# Altium schematic sheet 24 PIN MUX TABLE.SchDoc
size 513 x 386 mm
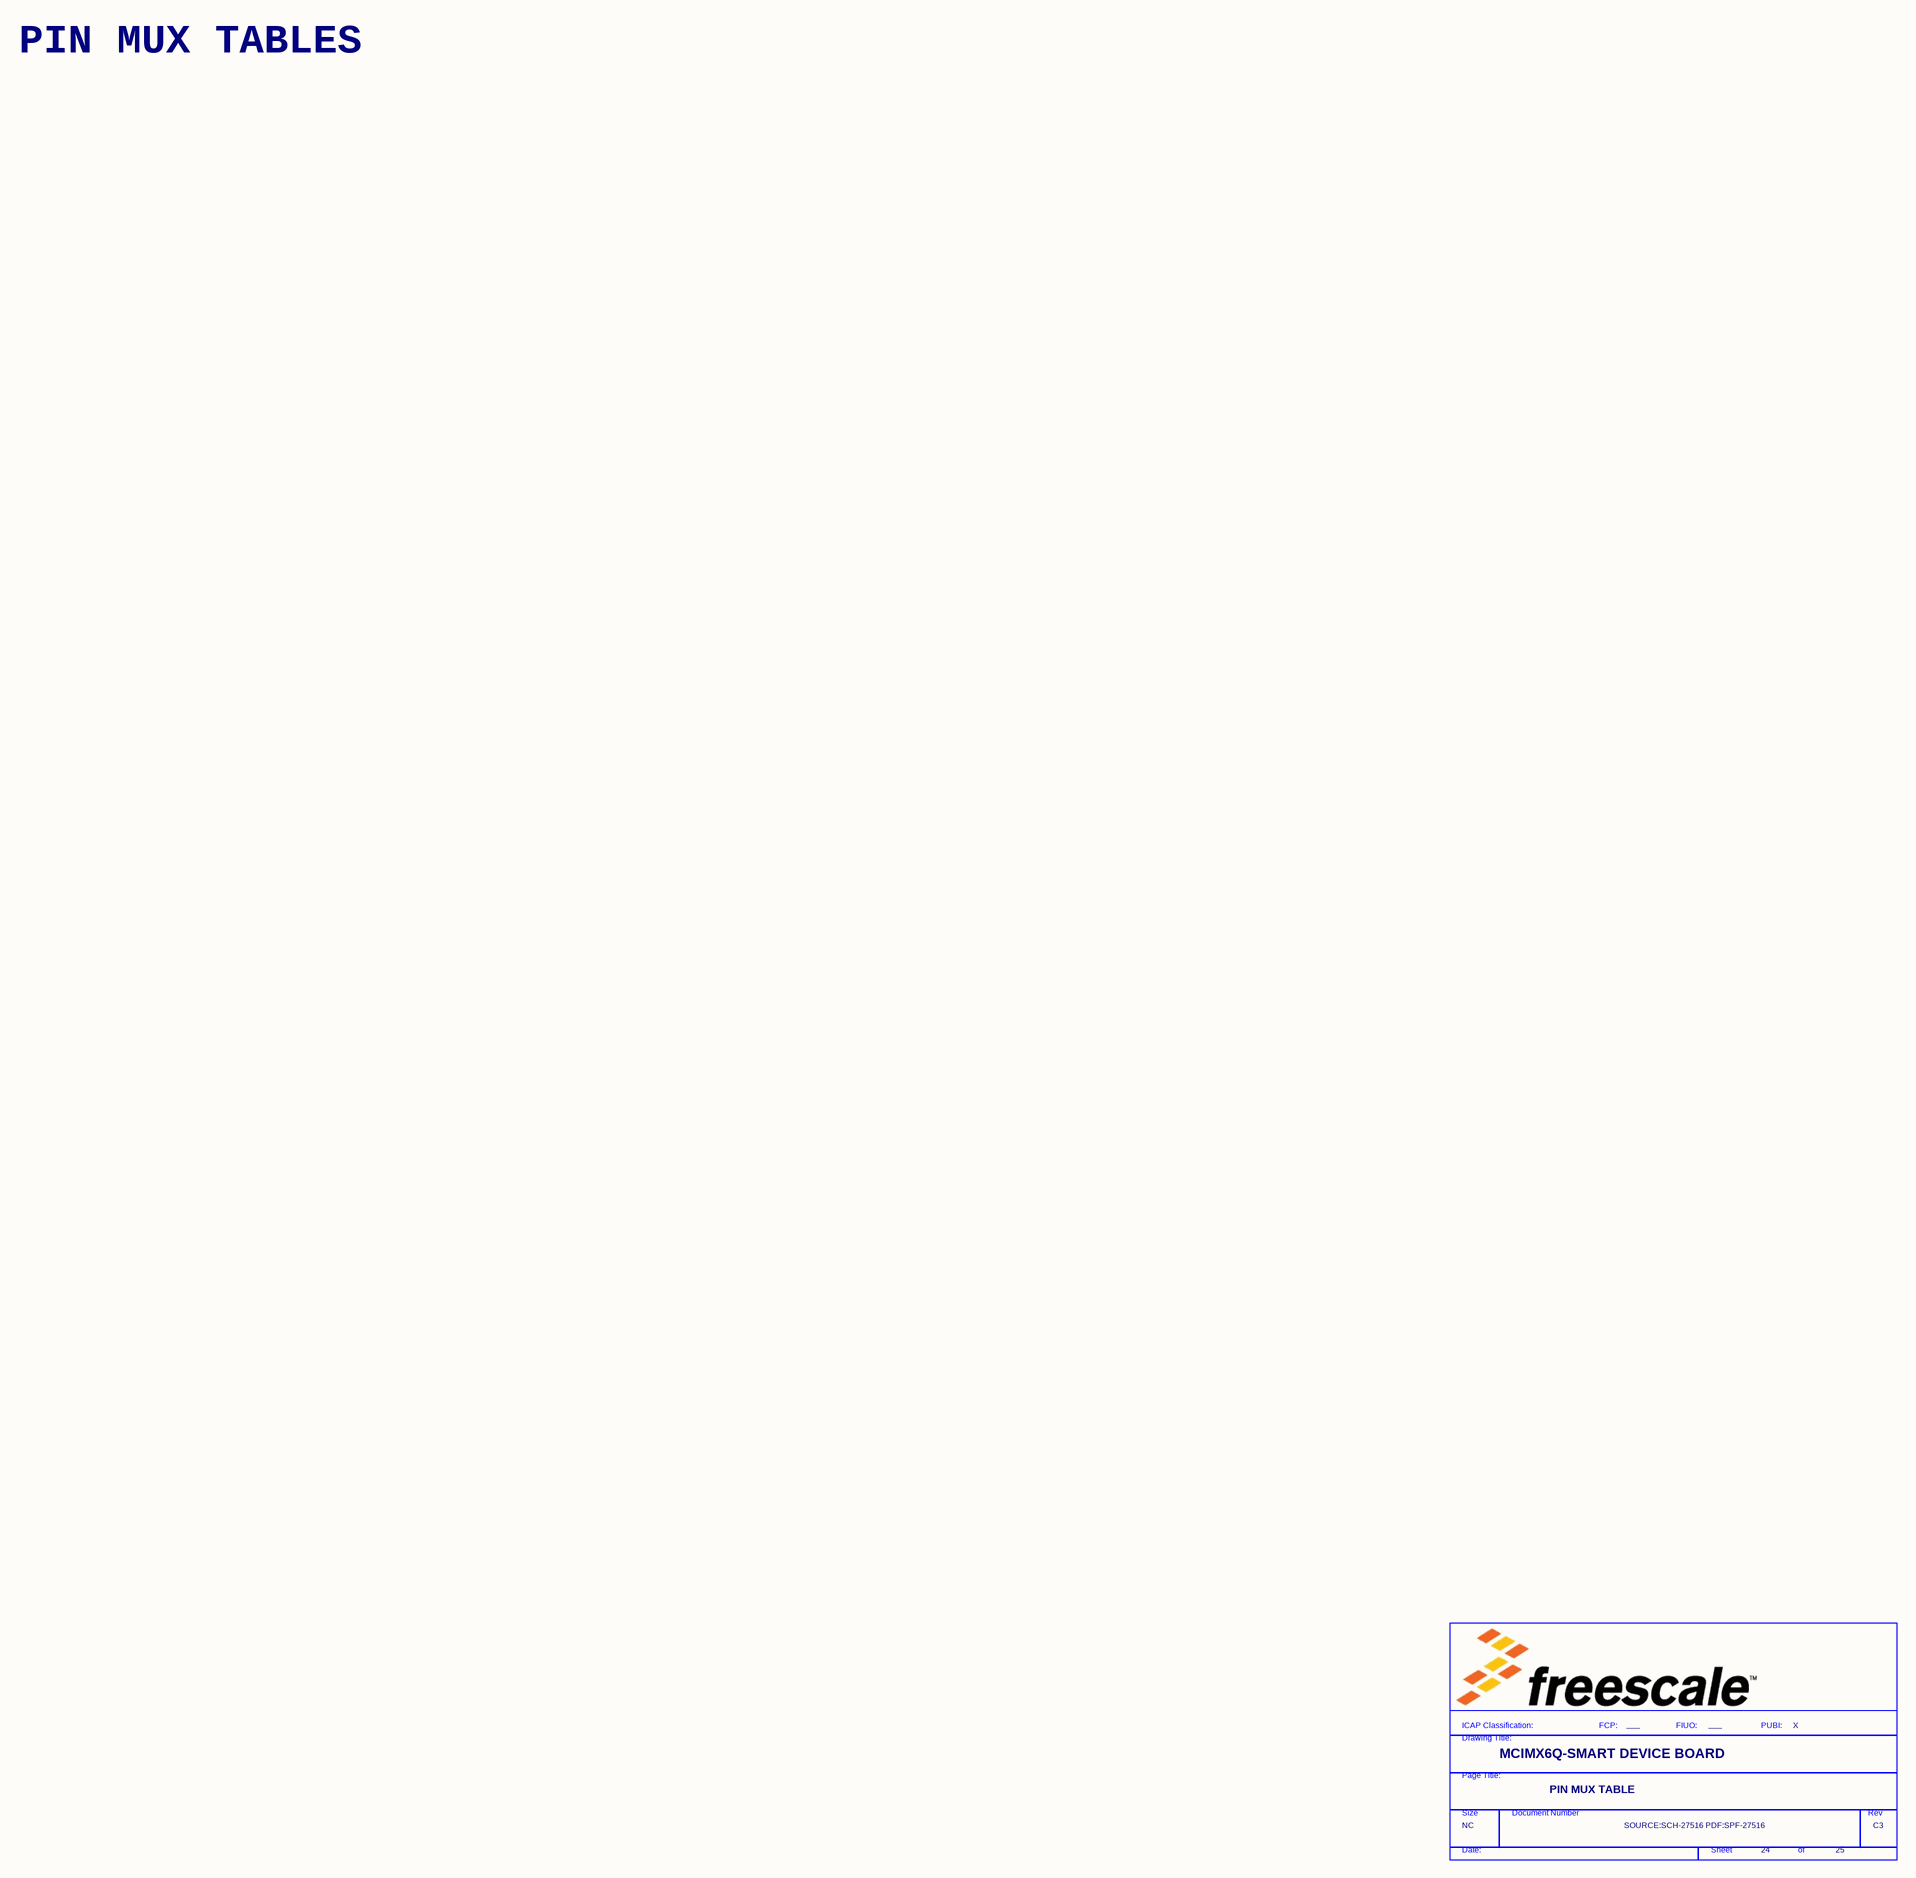
[diagram p0: 24 PIN MUX TABLE.SchDoc]

## Parts
*  FIUO: ___  PUBI: X  Doc: SOURCE:SCH-27516 PDF:SPF-27516  RevCode: C3  Title: MCIMX6Q-SMART DEVICE BOARD  Page Size: NC  Page Number: 24  Page Count: 25  PageTitle: PIN MUX TABLE  (hidden comment: TitleBlock_FS)  (graphical)

## Notes on the sheet
- PIN MUX TABLES
- (in symbol TitleBlock_FS) ICAP Classification:; FCP:; FIUO:; PUBI:; Drawing Title:; Page Title:; Size; Document Number; Rev; Date:; Sheet; of

## Library data of the parts
* = TitleBlock_FS: OrgAddr2: Austin, TX 78735-8598; OrgAddr1: 6501 William Cannon Drive West; OrgName: Freescale Semiconductor; FCP: ___; Page Create Date: March  8, 1995